# EAGLE design Rev A (EAGLE 6.5.0)

## Sheet 1 of 2
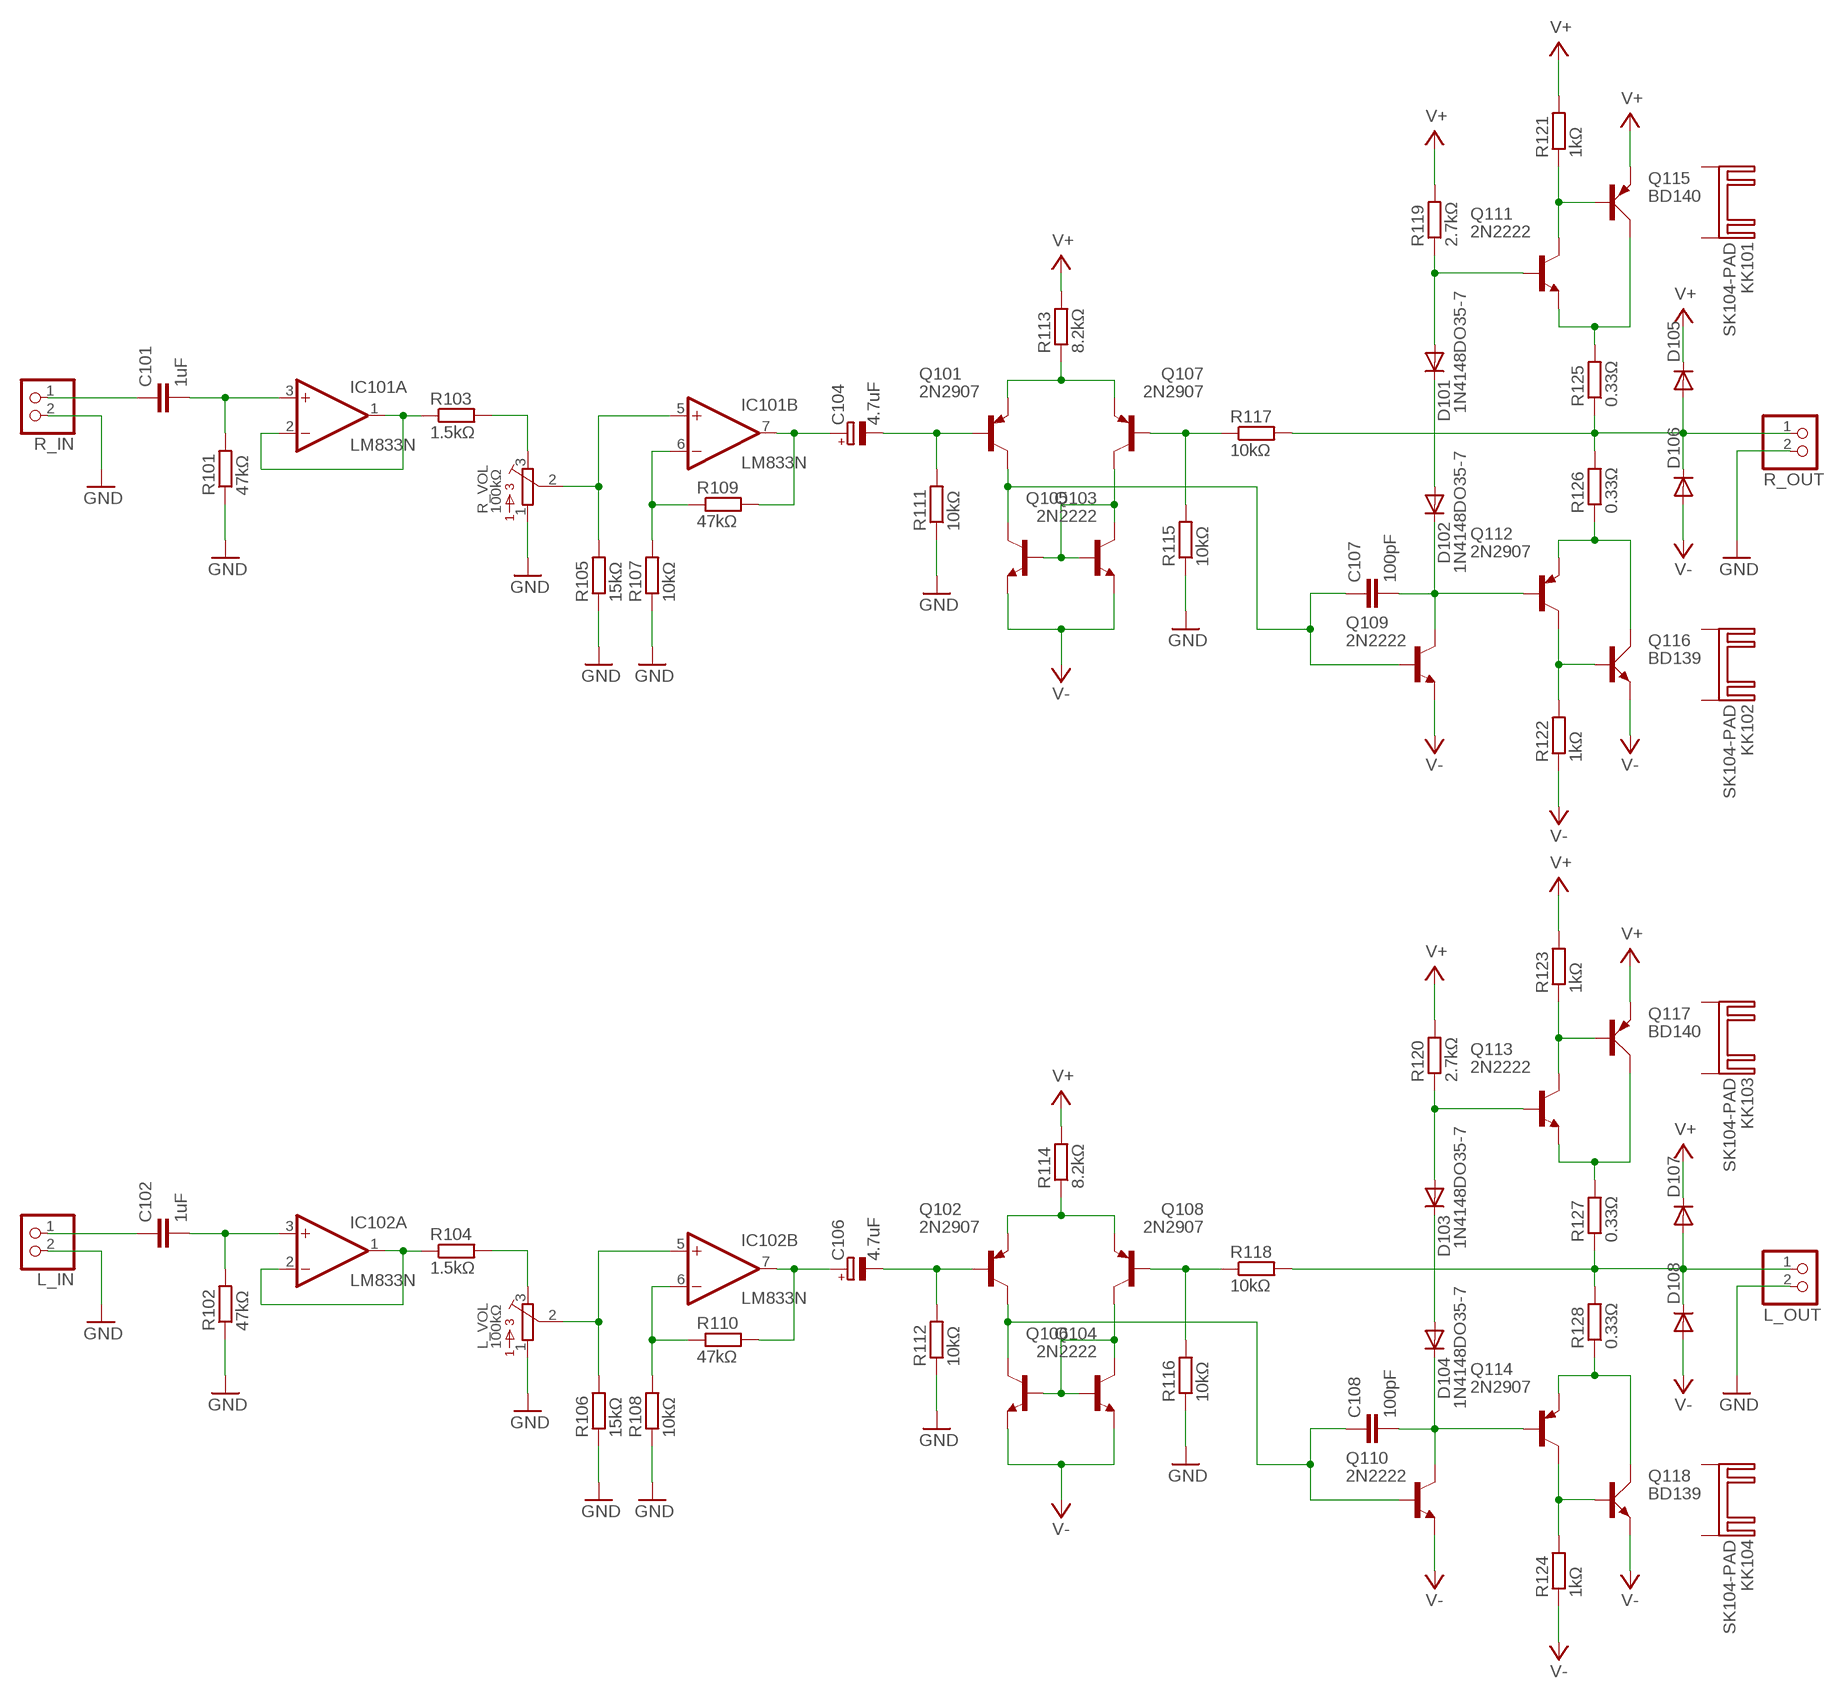
[diagram p0: schematic, sheet 1]

### Parts
C101  1uF  C-EU050-050X075  [C050-050X075]
C102  1uF  C-EU050-050X075  [C050-050X075]
C104  4.7uF  CPOL-EUE2-5  [E2-5]
C106  4.7uF  CPOL-EUE2-5  [E2-5]
C107  100pF  C-EU050-050X075  [C050-050X075]
C108  100pF  C-EU050-050X075  [C050-050X075]
D101  1N4148DO35-7  [DO35-7]
D102  1N4148DO35-7  [DO35-7]
D103  1N4148DO35-7  [DO35-7]
D104  1N4148DO35-7  [DO35-7]
D105  1N4148DO35-7  [DO35-7]
D106  1N4148DO35-7  [DO35-7]
D107  1N4148DO35-7  [DO35-7]
D108  1N4148DO35-7  [DO35-7]
IC101  LM833N  [DIL08]
IC102  LM833N  [DIL08]
KK101  SK104-PAD  [SK104-PAD]
KK102  SK104-PAD  [SK104-PAD]
KK103  SK104-PAD  [SK104-PAD]
KK104  SK104-PAD  [SK104-PAD]
L_IN  JST_2PIN-THM  [JST-PH-2-THM]
L_OUT  JST_2PIN-THM  [JST-PH-2-THM]
L_VOL  100kΩ  3362U  [3362U]
Q101  2N2907  [TO18]
Q102  2N2907  [TO18]
Q103  2N2222  [TO18]
Q104  2N2222  [TO18]
Q105  2N2222  [TO18]
Q106  2N2222  [TO18]
Q107  2N2907  [TO18]
Q108  2N2907  [TO18]
Q109  2N2222  [TO18]
Q110  2N2222  [TO18]
Q111  2N2222  [TO18]
Q112  2N2907  [TO18]
Q113  2N2222  [TO18]
Q114  2N2907  [TO18]
Q115  BD140  [TO126AV]
Q116  BD139  [TO126AV]
Q117  BD140  [TO126AV]
Q118  BD139  [TO126AV]
R101  47kΩ  R-EU_0207/10  [0207/10]
R102  47kΩ  R-EU_0207/10  [0207/10]
R103  1.5kΩ  R-EU_0207/10  [0207/10]
R104  1.5kΩ  R-EU_0207/10  [0207/10]
R105  15kΩ  R-EU_0207/10  [0207/10]
R106  15kΩ  R-EU_0207/10  [0207/10]
R107  10kΩ  R-EU_0207/10  [0207/10]
R108  10kΩ  R-EU_0207/10  [0207/10]
R109  47kΩ  R-EU_0207/10  [0207/10]
R110  47kΩ  R-EU_0207/10  [0207/10]
R111  10kΩ  R-EU_0207/10  [0207/10]
R112  10kΩ  R-EU_0207/10  [0207/10]
R113  8.2kΩ  R-EU_0207/10  [0207/10]
R114  8.2kΩ  R-EU_0207/10  [0207/10]
R115  10kΩ  R-EU_0207/10  [0207/10]
R116  10kΩ  R-EU_0207/10  [0207/10]
R117  10kΩ  R-EU_0207/10  [0207/10]
R118  10kΩ  R-EU_0207/10  [0207/10]
R119  2.7kΩ  R-EU_0207/10  [0207/10]
R120  2.7kΩ  R-EU_0207/10  [0207/10]
R121  1kΩ  R-EU_0207/10  [0207/10]
R122  1kΩ  R-EU_0207/10  [0207/10]
R123  1kΩ  R-EU_0207/10  [0207/10]
R124  1kΩ  R-EU_0207/10  [0207/10]
R125  0.33Ω  R-EU_0309/12  [0309/12]
R126  0.33Ω  R-EU_0309/12  [0309/12]
R127  0.33Ω  R-EU_0309/12  [0309/12]
R128  0.33Ω  R-EU_0309/12  [0309/12]
R_IN  JST_2PIN-THM  [JST-PH-2-THM]
R_OUT  JST_2PIN-THM  [JST-PH-2-THM]
R_VOL  100kΩ  3362U  [3362U]

### Nets
GND: L_IN.2 L_OUT.2 L_VOL.1 R101.1 R102.1 R105.1 R106.1 R107.1 R108.1 R111.1 R112.1 R115.1 R116.1 R_IN.2 R_OUT.2 R_VOL.1 ; also sheet 2
L_OUT: D107.A D108.C L_OUT.1 R118.2 R127.1 R128.2
N$1: D101.A Q111.2(B) R119.1
N$2: Q101.1(E) Q107.1(E) R113.1
N$3: Q103.2(B) Q105.2(B) Q105.3(C) Q107.3(C)
N$4: Q104.2(B) Q106.2(B) Q106.3(C) Q108.3(C)
N$5: C104.- Q101.2(B) R111.2
N$6: C104.+ IC101.7(B:OUT) R109.2
N$7: C101.1 R_IN.1
N$8: C107.1 Q101.3(C) Q103.3(C) Q109.2(B)
N$9: C101.2 IC101.3(A:+IN) R101.2
N$11: IC102.1(A:OUT) IC102.2(A:-IN) R104.1
N$12: IC102.5(B:+IN) L_VOL.2 R106.2
N$13: L_VOL.3 R104.2
N$14: IC102.6(B:-IN) R108.2 R110.1
N$15: C102.1 L_IN.1
N$16: C102.2 IC102.3(A:+IN) R102.2
N$24: D101.C D102.A
N$25: C106.- Q102.2(B) R112.2
N$26: Q111.3(C) Q115.B R121.1
N$27: Q112.3(C) Q116.B R122.2
N$28: Q112.1(E) Q116.C R126.1
N$29: Q111.1(E) Q115.C R125.2
N$30: C106.+ IC102.7(B:OUT) R110.2
N$31: C107.2 D102.C Q109.3(C) Q112.2(B)
N$32: Q107.2(B) R115.2 R117.1
N$33: Q102.1(E) Q108.1(E) R114.1
N$34: C108.1 Q102.3(C) Q104.3(C) Q110.2(B)
N$35: D103.C D104.A
N$36: D103.A Q113.2(B) R120.1
N$37: Q113.3(C) Q117.B R123.1
N$38: Q113.1(E) Q117.C R127.2
N$39: Q114.3(C) Q118.B R124.2
N$40: Q114.1(E) Q118.C R128.1
N$41: C108.2 D104.C Q110.3(C) Q114.2(B)
N$42: Q108.2(B) R116.2 R118.1
N$56: IC101.1(A:OUT) IC101.2(A:-IN) R103.1
N$58: IC101.5(B:+IN) R105.2 R_VOL.2
N$60: R103.2 R_VOL.3
N$62: IC101.6(B:-IN) R107.2 R109.1
R_OUT: D105.A D106.C R117.2 R125.1 R126.2 R_OUT.1
V+: D105.C D107.C Q115.E Q117.E R113.2 R114.2 R119.2 R120.2 R121.2 R123.2 ; also sheet 2
V-: D106.A D108.A Q103.1(E) Q104.1(E) Q105.1(E) Q106.1(E) Q109.1(E) Q110.1(E) Q116.E Q118.E R122.1 R124.1 ; also sheet 2
Unconnected: KK101.K1(K) KK101.K2(K) KK102.K1(K) KK102.K2(K) KK103.K1(K) KK103.K2(K) KK104.K1(K) KK104.K2(K)

## Sheet 2 of 2
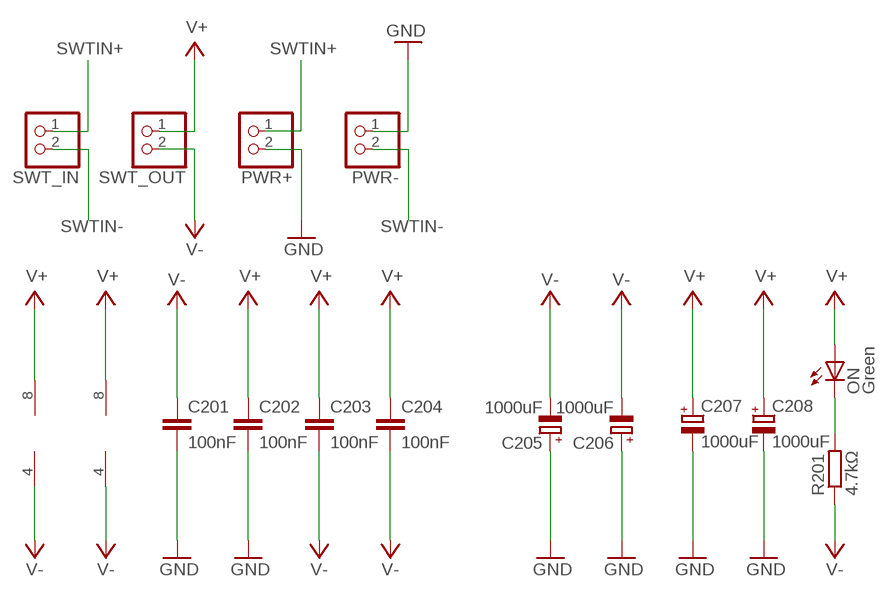
[diagram p1: schematic, sheet 2]

### Parts
C201  100nF  C-EU025-025X050  [C025-025X050]
C202  100nF  C-EU025-025X050  [C025-025X050]
C203  100nF  C-EU025-025X050  [C025-025X050]
C204  100nF  C-EU025-025X050  [C025-025X050]
C205  1000uF  CPOL-EUE5-10.5  [E5-10,5]
C206  1000uF  CPOL-EUE5-10.5  [E5-10,5]
C207  1000uF  CPOL-EUE5-10.5  [E5-10,5]
C208  1000uF  CPOL-EUE5-10.5  [E5-10,5]
ON  Green  LED5MM  [LED5MM]
PWR+  JST_2PIN-THM  [JST-PH-2-THM]
PWR-  JST_2PIN-THM  [JST-PH-2-THM]
R201  4.7kΩ  R-EU_0207/10  [0207/10]
SWT_IN  JST_2PIN-THM  [JST-PH-2-THM]
SWT_OUT  JST_2PIN-THM  [JST-PH-2-THM]

### Nets
GND: C201.2 C202.2 C205.+ C206.+ C207.- C208.- PWR+.2 PWR-.1 ; also sheet 1
N$10: ON.K(C) R201.2
SWTIN+: PWR+.1 SWT_IN.1
SWTIN-: PWR-.2 SWT_IN.2
V+: C202.1 C203.1 C204.1 C207.+ C208.+ IC101.8(P:V+) IC102.8(P:V+) ON.A SWT_OUT.1 ; also sheet 1
V-: C201.1 C203.2 C204.2 C205.- C206.- IC101.4(P:V-) IC102.4(P:V-) R201.1 SWT_OUT.2 ; also sheet 1

## Library data of the parts
C101 C102 C107 C108 C201-C204 = rcl:C-EU: CAPACITOR, European symbol
C104 C106 C205-C208 = rcl:CPOL-EU: POLARIZED CAPACITOR, European symbol
D101-D108 = diode:1N4148: DIODE high speed (Philips)
IC101 IC102 = linear:LM833: OP AMP
KK101-KK104 = heatsink:SK104-PAD: HEATSINK manufacturer Fischer/distributor Buerklin
L_IN L_OUT PWR+ PWR- R_IN R_OUT SWT_IN SWT_OUT = adafruit:JST_2PIN: JST 2-Pin Connectors of various flavors SMT-RA (S2B-PH-SM4) 4UConnector #17311 SMT (B2B-PH-SM4) THM-RA (S2B-PH) THM (B2B-PH)
L_VOL R_VOL = bourns:3362: 3362 Series 1/4" Square Trimmer
ON = led:LED: LED OSRAM: - CHIPLED LG R971, LG N971, LY N971, LG Q971, LY Q971, LO R971, LY R971 LH N974, LH R974 LS Q976, LO Q976, LY Q976 LO Q996 - Hyper CHIPLED LW Q18S LB Q993, LB Q99A, LB R99A - SideLED LS A670, LO A670, LY A670, LG A670, LP A670 LB A673, LV A673, LT A673, LW A673 LH A674 LY A675 LS A676, LA A676, LO A676, LY A676, LW A676 LS A679, LY A679, LG A679 - Hyper Micro SIDELED® LS Y876, LA Y876, LO Y876, LY Y876 LT Y87S - SmartLED LW L88C, LW L88S LB L89C, LB L89S, LG L890 LS L89K, LO L89K, LY L89K LS L896, LA L896, LO L896, LY L896 - TOPLED LS T670, LO T670, LY T670, LG T670, LP T670 LSG T670, LSP T670, LSY T670, LOP T670, LYG T670 LG T671, LOG T671, LSG T671 LB T673, LV T673, LT T673, LW T673 LH T674 LS T676, LA T676, LO T676, LY T676, LB T676, LH T676, LSB T676, LW T676 LB T67C, LV T67C, LT T67C, LS T67K, LO T67K, LY T67K, LW E67C LS E67B, LA E67B, LO E67B, LY E67B, LB E67C, LV E67C, LT E67C LW T67C LS T679, LY T679, LG T679 LS T770, LO T770, LY T770, LG T770, LP T770 LB T773, LV T773, LT T773, LW T773 LH T774 LS E675, LA E675, LY E675, LS T675 LS T776, LA T776, LO T776, LY T776, LB T776 LHGB T686 LT T68C, LB T68C - Hyper Mini TOPLED® LB M676 - Mini TOPLED Santana® LG M470 LS M47K, LO M47K, LY M47K Source: http://www.osram.convergy.de LUXEON: - LUMILED® LXK2-PW12-R00, LXK2-PW12-S00, LXK2-PW14-U00, LXK2-PW14-V00 LXK2-PM12-R00, LXK2-PM12-S00, LXK2-PM14-U00 LXK2-PE12-Q00, LXK2-PE12-R00, LXK2-PE12-S00, LXK2-PE14-T00, LXK2-PE14-U00 LXK2-PB12-K00, LXK2-PB12-L00, LXK2-PB12-M00, LXK2-PB14-N00, LXK2-PB14-P00, LXK2-PB14-Q00 LXK2-PR12-L00, LXK2-PR12-M00, LXK2-PR14-Q00, LXK2-PR14-R00 LXK2-PD12-Q00, LXK2-PD12-R00, LXK2-PD12-S00 LXK2-PH12-R00, LXK2-PH12-S00 LXK2-PL12-P00, LXK2-PL12-Q00, LXK2-PL12-R00 Source: www.luxeon.com KINGBRIGHT: KA-3528ASYC Source: www.kingbright.com
Q101 Q102 Q107 Q108 Q112 Q114 = transistor-pnp:2N2907*: PNP Transistor
Q103-Q106 Q109-Q111 Q113 = transistor:2N2222: NPN TRANSISTOR
Q115 Q117 = transistor-power:BD140: PNP TRANSISTOR
Q116 Q118 = transistor-power:BD139: NPN TRANSISTOR
R101-R128 R201 = rcl:R-EU_: RESISTOR, European symbol

## Board
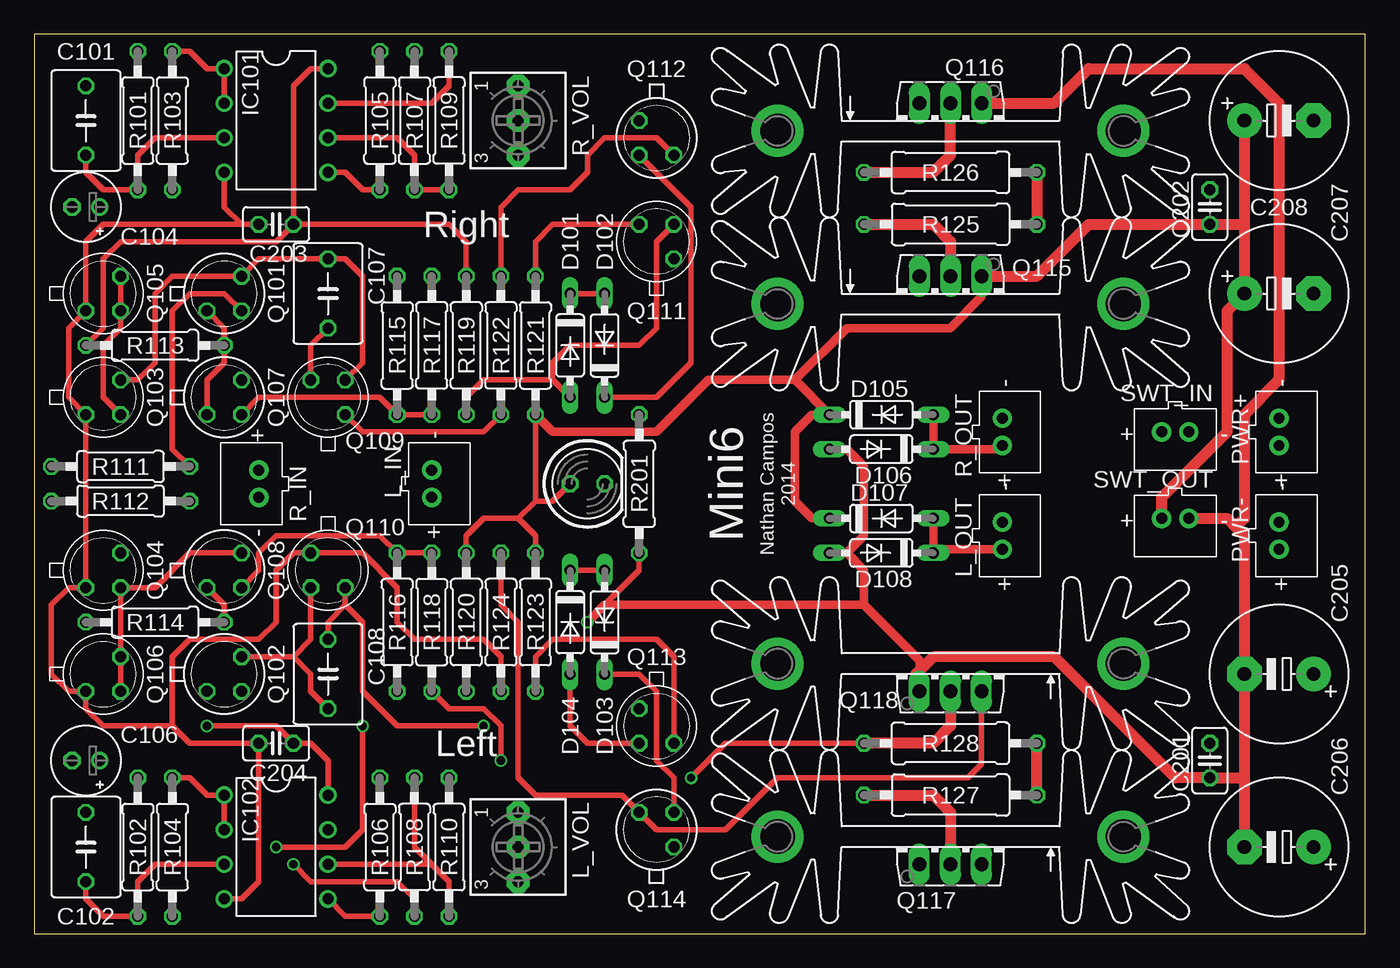
[diagram p2: board, top side]
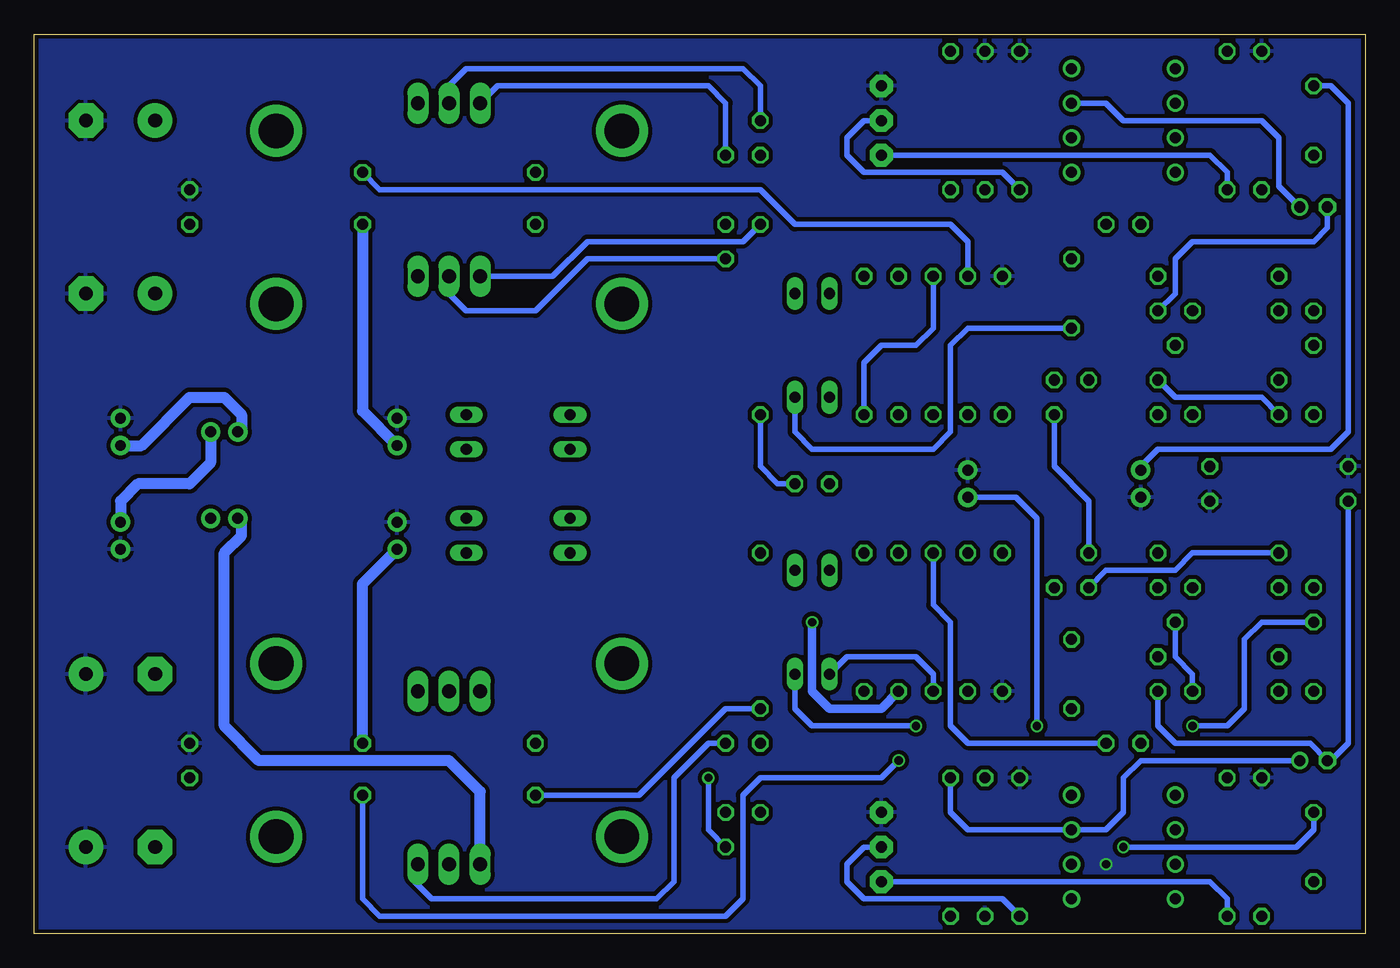
[diagram p3: board, bottom side, seen from below]

Size 97.79 x 66.04 mm. Coordinates in mm from the lower left corner, seen from the top.
Outline: 0,0 97.79,0 97.79,66.04 0,66.04 0,0
Copper layers (1*2*15*16): Top 0.035mm / dielectric 0.2mm / Route2 0.0175mm / dielectric 1.1mm / Route15 0.0175mm / dielectric 0.2mm / Bottom 0.035mm
Design rules "SeeedStudio_DRU_no_angle_20130527": minimum track width 6mil, minimum drill 12mil, track to track 6mil, track to pad 6mil, pad to pad 6mil, via to via 6mil, smd to smd 0mil, copper to edge 10mil, drill to drill 10mil, minimum pad ring 6mil, minimum via ring 6mil, stop-mask expansion 2mil, vias tented up to drill 25mil, thermal gap 10mil
bRestrict: area 26.7,0 to 29.2,1.3

### Footprints (pad centres in the part's own frame; a part is rotated, then mirrored left to right if it is on the bottom)
C050-050X075 = drill 0.813 octagon: 1 -2.54,0; 2 2.54,0
E2-5 = drill 0.813 pad 1.27: + -1.016,0 | drill 0.813 pad 1.27 octagon: - 1.016,0
C025-025X050 = drill 0.813 octagon: 1 -1.27,0; 2 1.27,0
E5-10,5 = drill 1.016 pad 2.54: + -2.54,0 | drill 1.016 pad 2.54 octagon: - 2.54,0
DO35-7 = drill 0.813 long: A 3.81,0; C -3.81,0
DIL08 = drill 0.813 pad 1.27: 1 -3.81,-3.81; 2 -1.27,-3.81; 3 1.27,-3.81; 4 3.81,-3.81; 5 3.81,3.81; 6 1.27,3.81; 7 -1.27,3.81; 8 -3.81,3.81
SK104-PAD = drill 2.54 pad 3.81: K1 -12.7,-0.762; K2 12.7,-0.762
JST-PH-2-THM = drill 0.8 pad 1.422: 1 1,0; 2 -1,0
3362U = drill 0.813 pad 1.676 octagon: 1 -2.54,0; 2 0,0; 3 2.54,0
LED5MM = drill 0.813 octagon: A -1.27,0; K 1.27,0
TO18 = drill 0.813 octagon: 1 -1.27,-1.27; 2 1.27,-1.27; 3 1.27,1.27
TO126AV = drill 1.016 long: B 2.286,-1.27; C 0,-1.27; E -2.286,-1.27
0207/10 = drill 0.813 octagon: 1 -5.08,0; 2 5.08,0
0309/12 = drill 0.813 octagon: 1 -6.35,0; 2 6.35,0

### Placement (x,y rotation side)
C101  3.81,59.69 270 top
C102  3.81,6.35 270 top
C104  3.81,53.34 180 top
C106  3.81,12.7 180 top
C107  21.59,46.99 270 top
C108  21.59,19.05 90 top
C201  86.36,12.7 90 top
C202  86.36,53.34 90 top
C203  17.78,52.07 180 top
C204  17.78,13.97 180 top
C205  91.44,19.05 180 top
C206  91.44,6.35 180 top
C207  91.44,46.99 0 top
C208  91.44,59.69 0 top
D101  39.37,43.18 270 top
D102  41.91,43.18 90 top
D103  39.37,22.86 270 top
D104  41.91,22.86 90 top
D105  62.23,38.1 0 top
D106  62.23,35.56 180 top
D107  62.23,30.48 0 top
D108  62.23,27.94 180 top
IC101  17.78,59.69 270 top
IC102  17.78,6.35 270 top
KK101  67.31,46.99 0 top
KK102  67.31,59.69 0 top
KK103  67.31,19.05 180 top
KK104  67.31,6.35 180 top
L_IN  29.21,33.02 270 top
L_OUT  71.12,29.21 270 top
L_VOL  35.56,6.35 270 top
ON  40.64,33.02 0 top
PWR+  91.44,36.83 270 top
PWR-  91.44,29.21 270 top
Q101  13.97,46.99 0 top
Q102  13.97,19.05 0 top
Q103  5.08,39.37 0 top
Q104  5.08,26.67 0 top
Q105  5.08,46.99 0 top
Q106  5.08,19.05 0 top
Q107  13.97,39.37 0 top
Q108  13.97,26.67 0 top
Q109  21.59,39.37 90 top
Q110  21.59,26.67 270 top
Q111  45.72,50.8 90 top
Q112  45.72,58.42 270 top
Q113  45.72,15.24 270 top
Q114  45.72,7.62 90 top
Q115  67.31,46.99 180 top
Q116  67.31,59.69 180 top
Q117  67.31,6.35 0 top
Q118  67.31,19.05 0 top
R101  7.62,59.69 270 top
R102  7.62,6.35 270 top
R103  10.16,59.69 270 top
R104  10.16,6.35 270 top
R105  25.4,59.69 270 top
R106  25.4,6.35 270 top
R107  27.94,59.69 270 top
R108  27.94,6.35 90 top
R109  30.48,59.69 90 top
R110  30.48,6.35 90 top
R111  6.35,34.29 0 top
R112  6.35,31.75 180 top
R113  8.89,43.18 180 top
R114  8.89,22.86 180 top
R115  26.67,43.18 270 top
R116  26.67,22.86 90 top
R117  29.21,43.18 90 top
R118  29.21,22.86 270 top
R119  31.75,43.18 90 top
R120  31.75,22.86 90 top
R121  36.83,43.18 270 top
R122  34.29,43.18 90 top
R123  36.83,22.86 90 top
R124  34.29,22.86 90 top
R125  67.31,52.07 180 top
R126  67.31,55.88 0 top
R127  67.31,10.16 180 top
R128  67.31,13.97 0 top
R201  44.45,33.02 90 top
R_IN  16.51,33.02 90 top
R_OUT  71.12,36.83 270 top
R_VOL  35.56,59.69 270 top
SWT_IN  83.82,36.83 180 top
SWT_OUT  83.82,30.48 180 top

### Tracks (layer width: path | path; a pad name or v marks a point on that pad's centre or on a via)
GND  (via drill 0.6)
  Top 0.406: R108.1 27.94,2.54 26.67,3.81 20.32,3.81 v19.05,5.08
  pour Bottom (isolate 0.305): 0,66.04 97.79,66.04 97.79,0 0,0
L_OUT  (via drill 0.6)
  Top 0.406: R118.2 30.48,16.51 33.02,16.51 34.29,15.24 v34.29,12.7
  Top 0.61: D107.A D108.C 66.31,28.21 L_OUT.1
  Top 0.813: R127.1 R128.2
  Bottom 0.406: R127.1 73.66,2.54 72.39,1.27 46.99,1.27 45.72,2.54 45.72,10.16 44.45,11.43 35.56,11.43 v34.29,12.7
  Bottom 0.813: R128.2 73.66,25.67 L_OUT.1
N$1
  Top 0.406: R119.1 31.75,39.37 33.02,40.64 38.1,40.64 | 38.1,40.64 D101.A | 38.1,40.64 38.1,41.91 39.37,43.18 44.45,43.18 45.72,44.45 45.72,50.8 Q111.2
N$2
  Top 0.406: Q101.1 13.97,44.45 R113.1 13.97,41.91 12.7,40.64 Q107.1
N$3
  Top 0.406: Q103.2 5.08,39.37 5.08,43.18 6.35,44.45 Q105.2 Q105.3
  Bottom 0.406: Q107.3 13.97,39.37 7.62,39.37 Q103.2
N$4
  Top 0.406: Q106.2 Q106.3 Q104.2 8.89,25.4 11.43,27.94 Q108.3
N$5
  Top 0.406: R111.2 10.16,35.56 10.16,45.72 11.43,46.99 13.97,46.99 Q101.2
  Bottom 0.406: C104.- 2.79,51.82 3.81,50.8 12.7,50.8 13.97,49.53 13.97,46.99 Q101.2
N$6
  Top 0.406: R109.2 30.48,62.23 29.21,60.96 IC101.7
  Bottom 0.406: IC101.7 19.05,60.96 17.78,59.69 7.62,59.69 6.35,58.42 6.35,54.86 C104.+
N$7
  Bottom 0.406: R_IN.1 16.51,34.29 15.24,35.56 2.54,35.56 1.27,36.83 1.27,60.96 2.54,62.23 C101.1
N$8
  Top 0.406: Q103.3 7.62,40.64 8.89,41.91 8.89,46.99 10.16,48.26 Q101.3 16.51,49.53 C107.1 22.86,49.53 24.13,48.26 24.13,41.91 Q109.2
N$9
  Top 0.406: C101.2 3.81,55.88 5.08,54.61 R101.2 7.62,57.15 8.89,58.42 IC101.3
N$10
  Bottom 0.406: R201.2 44.45,34.29 43.18,33.02 ON.K
N$11
  Top 0.406: IC102.2 IC102.1 12.7,10.16 11.43,11.43 R104.1
N$12
  Top 0.406: R106.2 22.86,1.27 IC102.5
  Bottom 0.406: R106.2 26.67,2.54 36.83,2.54 38.1,3.81 38.1,5.08 36.83,6.35 L_VOL.2
N$13
  Bottom 0.406: R104.2 10.16,2.54 11.43,3.81 L_VOL.3
N$14
  Top 0.406: R110.1 30.48,3.81 29.21,5.08 | 29.21,5.08 IC102.6 | R108.2 27.94,6.35 29.21,5.08
N$15  (via drill 0.6)
  Top 0.406: v24.13,15.24 24.13,7.62 22.86,6.35 v17.78,6.35
  Bottom 0.406: L_IN.1 25.67,32.02 24.13,30.48 v24.13,15.24 | v17.78,6.35 5.08,6.35 3.81,7.62 C102.1
N$16
  Top 0.406: C102.2 3.81,2.54 5.08,1.27 R102.2 7.62,3.81 8.89,5.08 IC102.3
N$24
  Top 0.406: D101.C D102.A
N$25
  Bottom 0.406: Q102.2 15.24,15.24 13.97,13.97 4.06,13.97 C106.- 2.54,12.7 1.27,13.97 R112.2
N$26
  Top 0.406: R121.1 36.83,50.8 38.1,52.07 Q111.3
  Bottom 0.406: Q111.3 45.72,50.8 57.15,50.8 59.69,48.26 Q115.B
N$27
  Top 0.406: R122.2 34.29,53.34 35.56,54.61 39.37,54.61 40.64,55.88 40.64,57.15 41.91,58.42 45.72,58.42 Q112.3
  Bottom 0.406: Q112.3 46.99,60.96 48.26,62.23 63.75,62.23 Q116.B
N$28
  Top 0.813: R126.1 66.04,55.88 67.31,57.15 Q116.C
  Bottom 0.406: Q112.1 44.45,62.23 45.72,63.5 66.04,63.5 67.31,62.23 Q116.C
N$29
  Top 0.813: R125.2 66.04,52.07 67.31,50.8 Q115.C
  Bottom 0.406: Q111.1 57.15,49.53 60.96,45.72 66.04,45.72 67.31,46.99 Q115.C
N$30
  Bottom 0.406: R110.2 30.48,8.89 29.21,7.62 IC102.7 19.05,7.62 17.78,8.89 17.78,11.43 16.51,12.7 C106.+
N$31
  Top 0.406: Q109.3 20.32,43.18 C107.2 | D102.C 45.72,39.37 48.26,41.91 48.26,53.34 Q112.2
  Bottom 0.406: C107.2 29.21,44.45 30.48,43.18 30.48,36.83 31.75,35.56 40.64,35.56 41.91,36.83 D102.C
N$32
  Top 0.406: Q107.2 16.51,39.37 25.4,39.37 R115.2 R117.1
N$33
  Top 0.406: Q108.1 13.97,24.13 R114.1
  Bottom 0.406: Q102.1 12.7,19.05 13.97,20.32 R114.1
N$34
  Top 0.406: Q102.3 19.05,20.32 | 19.05,20.32 20.32,19.05 20.32,17.78 C108.1 | Q110.2 20.32,21.59 19.05,20.32
  Bottom 0.406: Q104.3 12.7,27.94 13.97,26.67 19.05,26.67 Q110.2
N$35
  Top 0.406: D104.A D103.C
N$36
  Top 0.406: D103.A 39.37,15.24 40.64,13.97 Q113.2
  Bottom 0.406: R120.1 31.75,19.05 33.02,20.32 38.1,20.32 D103.A
N$37
  Top 0.406: Q113.3 46.99,20.32 45.72,21.59 38.1,21.59 36.83,20.32 R123.1
  Bottom 0.406: Q113.3 48.26,13.97 50.8,11.43 50.8,3.81 52.07,2.54 68.58,2.54 69.85,3.81 69.85,4.83 Q117.B
N$38
  Top 0.813: R127.2 66.04,10.16 67.31,8.89 Q117.C
  Bottom 0.406: Q113.1 46.99,16.51 53.34,10.16 R127.2
N$39
  Top 0.406: R124.2 34.29,24.13 35.56,22.86 35.56,11.43 36.83,10.16 43.18,10.16 Q114.3 45.72,7.62 50.8,7.62 54.61,11.43 68.58,11.43 69.6,12.45 Q118.B
N$40  (via drill 0.6)
  Top 0.406: R128.1 50.8,13.97 v48.26,11.43
  Top 0.813: Q118.C 67.31,15.24 66.04,13.97 R128.1
  Bottom 0.406: v48.26,11.43 48.26,7.62 Q114.1
N$41  (via drill 0.6)
  Top 0.406: Q110.3 22.86,24.13 | 22.86,24.13 21.59,22.86 C108.2 | 22.86,24.13 24.13,22.86 24.13,17.78 26.67,15.24 v33.02,15.24 | Q114.2 46.99,11.43 45.72,12.7 45.72,17.78 44.45,19.05 D104.C
  Bottom 0.406: v33.02,15.24 40.64,15.24 41.91,16.51 D104.C
N$42
  Top 0.406: Q108.2 16.51,26.67 16.51,27.94 17.78,29.21 25.4,29.21 R116.2 R118.1
N$56
  Top 0.406: R103.1 11.43,64.77 12.7,63.5 IC101.1 IC101.2
N$58
  Top 0.406: IC101.5 22.86,55.88 24.13,54.61 R105.2
  Bottom 0.406: R105.2 26.67,55.88 36.83,55.88 38.1,57.15 38.1,58.42 36.83,59.69 R_VOL.2
N$60
  Bottom 0.406: R103.2 10.16,55.88 11.43,57.15 R_VOL.3
N$62
  Top 0.406: R109.1 R107.2 27.94,57.15 26.67,58.42 IC101.6
R_OUT
  Top 0.61: D105.A D106.C 70.85,35.56 R_OUT.1
  Top 0.813: R126.2 R125.1
  Bottom 0.406: R117.2 29.21,50.8 30.48,52.07 41.91,52.07 44.45,54.61 72.39,54.61 R126.2
  Bottom 0.813: R125.1 73.66,38.37 R_OUT.1
SWTIN+
  Bottom 0.813: PWR+.1 89.9,35.83 86.36,39.37 83.82,39.37 82.55,38.1 82.55,37.1 SWT_IN.1
SWTIN-
  Bottom 0.813: SWT_IN.2 84.82,34.56 86.36,33.02 90.17,33.02 91.44,31.75 PWR-.2
V+  (via drill 0.6)
  Top 0.406: IC102.8 21.59,12.7 20.32,13.97 C204.1 17.78,15.24 v12.7,15.24 | R120.2 31.75,29.21 33.02,30.48 35.56,30.48 | 35.56,30.48 36.83,29.21 R123.2 | R121.2 36.83,31.75 | 36.83,31.75 35.56,30.48 | IC101.8 20.32,63.5 19.05,62.23 C203.1 | C203.1 17.78,50.8 6.35,50.8 5.08,49.53 5.08,44.45 R113.2 | C203.1 30.48,52.07 31.75,50.8 R119.2 | 36.83,31.75 38.1,31.75 ON.A
  Top 0.61: Q115.E 69.6,46.74 67.31,44.45 59.69,44.45 55.88,40.64 | 55.88,40.64 49.53,40.64 45.72,36.83 38.1,36.83 R121.2 | 55.88,40.64 D105.C 57.15,38.1 55.88,36.83 55.88,31.75 57.15,30.48 D107.C
  Top 0.813: SWT_OUT.1 82.82,32.02 87.63,36.83 87.63,45.72 C207.+ 88.9,52.07 | C208.+ 88.9,52.07 | 88.9,52.07 C202.1 77.47,52.07 73.66,48.26 Q115.E
  Bottom 0.406: R121.2 36.83,41.91 35.56,43.18 33.02,43.18 31.75,44.45 R119.2 | R114.2 7.62,22.86 8.89,21.59 8.89,16.51 10.16,15.24 v12.7,15.24 | R120.2 31.75,24.13 30.48,22.86 30.48,15.24 29.21,13.97 C204.1
  Bottom 0.813: Q117.E 65.02,10.41 67.31,12.7 81.28,12.7 83.82,15.24 83.82,27.94 82.55,29.21 82.55,30.21 SWT_OUT.1
V-  (via drill 0.6)
  Top 0.406: R122.1 33.02,36.83 24.13,36.83 Q109.1 | 10.16,15.24 10.16,20.32 11.43,21.59 16.51,21.59 17.78,22.86 17.78,26.67 19.05,27.94 Q110.1 24.13,27.94 26.67,25.4 26.67,22.86 27.94,21.59 33.02,21.59 34.29,20.32 R124.1 | 10.16,15.24 11.43,13.97 C204.2 16.51,3.81 15.24,2.54 IC102.4 | 10.16,15.24 5.08,15.24 3.81,16.51 Q106.1 2.54,17.78 1.27,19.05 1.27,24.13 2.54,25.4 Q104.1 Q103.1 2.54,39.37 2.54,44.45 Q105.1 3.81,50.8 5.08,52.07 C203.2 15.24,52.07 13.97,53.34 IC101.4 | R201.1 44.45,26.67 41.91,24.13
  Top 0.61: Q118.E 65.02,20.07 60.96,24.13 | 60.96,24.13 41.91,24.13 v40.64,22.86 | 59.69,27.94 60.96,29.21 60.96,34.29 59.69,35.56 D106.A | D108.A 59.69,27.94 | 59.69,27.94 60.96,26.67 60.96,24.13
  Top 0.813: SWT_OUT.2 87.63,30.48 88.27,29.84 | 88.27,29.84 88.9,29.21 C205.- 88.9,11.43 | 88.9,11.43 C206.- | 88.9,11.43 C201.1 83.82,11.43 74.93,20.32 66.04,20.32 64.77,19.05 64.77,18.03 Q118.E | Q116.E 74.93,60.96 77.47,63.5 88.9,63.5 91.44,60.96 91.44,40.64 88.9,38.1 88.9,30.48 88.27,29.84
  Bottom 0.406: Q110.1 20.32,31.75 22.86,34.29 Q109.1
  Bottom 0.61: v40.64,22.86 40.64,17.78 39.37,16.51 35.56,16.51 R124.1

### Text on the board
tPlace: Right | Mini6 | Nathan Campos / 2014 | Left